# Altium project Triumvi_v9_mcu.PrjPcb
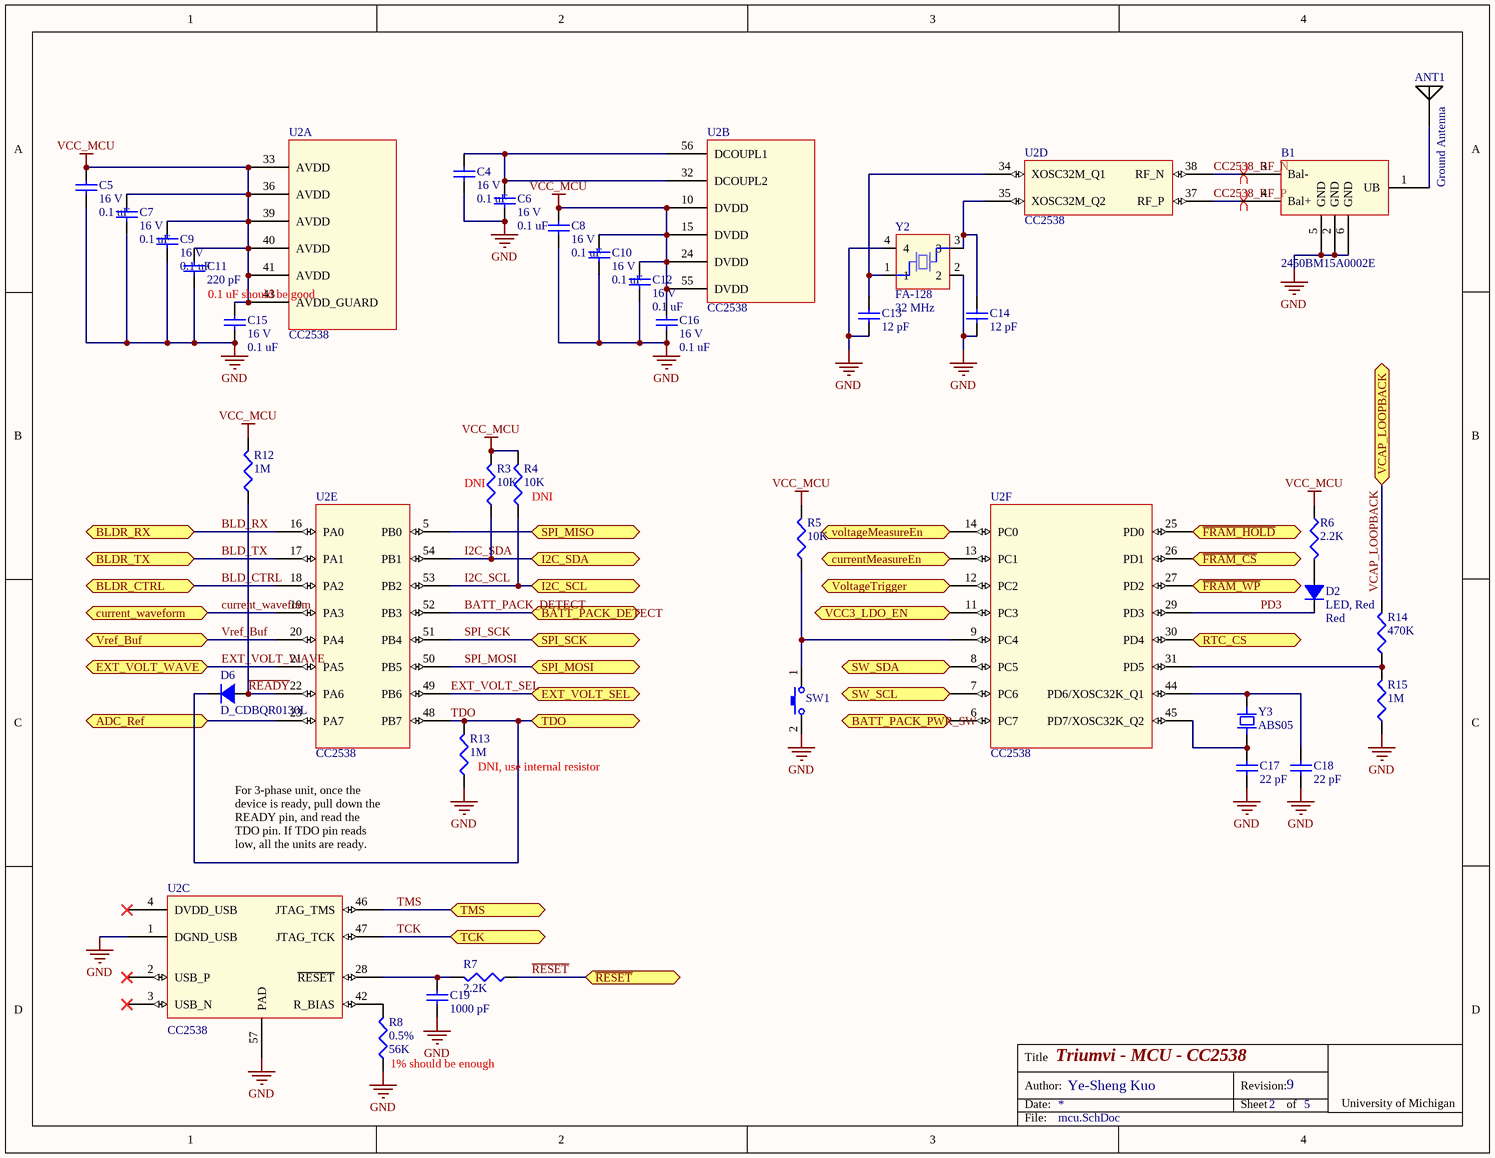
[diagram p0: mcu.SchDoc]
3 sheets, 56 parts. Net scope: flat (ports and power ports of the same name join across sheets).
Board files: triumvi_v9_mcu.PcbDoc, triumvi_v9_mcu_panel.PcbDoc
Sheets:
  mcu.SchDoc
  power_supply.SchDoc
  connectors.SchDoc

## Sheet mcu.SchDoc: Triumvi - MCU - CC2538
size Letter; Author: Ye-Sheng Kuo; Revision: 9; SheetNumber: 2; SheetTotal: 5

### Parts
ANT1  Ground Antenna  [Chip Antenna]
B1  2450BM15A0002E  [2450BM15A0002]
C4  value 0.1 uF  voltage rated: 16 V  [0402]  (hidden comment: Ceramic capacitor)
C5  value 0.1 uF  voltage rated: 16 V  [0402]  (hidden comment: Ceramic capacitor)
C6  value 0.1 uF  voltage rated: 16 V  [0402]  (hidden comment: Ceramic capacitor)
C7  value 0.1 uF  voltage rated: 16 V  [0402]  (hidden comment: Ceramic capacitor)
C8  value 0.1 uF  voltage rated: 16 V  [0402]  (hidden comment: Ceramic capacitor)
C9  value 0.1 uF  voltage rated: 16 V  [0402]  (hidden comment: Ceramic capacitor)
C10  value 0.1 uF  voltage rated: 16 V  [0402]  (hidden comment: Ceramic capacitor)
C11  value 220 pF  [0402]  (hidden comment: Ceramic capacitor)
C12  value 0.1 uF  voltage rated: 16 V  [0402]  (hidden comment: Ceramic capacitor)
C13  value 12 pF  [0402]  (hidden comment: Ceramic capacitor)
C14  value 12 pF  [0402]  (hidden comment: Ceramic capacitor)
C15  value 0.1 uF  voltage rated: 16 V  [0402]  (hidden comment: Ceramic capacitor)
C16  value 0.1 uF  voltage rated: 16 V  [0402]  (hidden comment: Ceramic capacitor)
C17  value 22 pF  [0402]  (hidden comment: Ceramic capacitor)
C18  value 22 pF  [0402]  (hidden comment: Ceramic capacitor)
C19  value 1000 pF  [0402]  (hidden comment: Ceramic capacitor)
D2  LED, Red  Color: Red  [0402 - DIODE]
D6  D_CDBQR0130L  [0402 - DIODE]
R3  value 10K  [0402]  (hidden comment: Chip resistor)
R4  value 10K  [0402]  (hidden comment: Chip resistor)
R5  value 10K  [0402]  (hidden comment: Chip resistor)
R6  value 2.2K  [0402]  (hidden comment: Chip resistor)
R7  value 2.2K  [0402]  (hidden comment: Chip resistor)
R8  value 56K  tolerance: 0.5%  [0402]  (hidden comment: Chip resistor)
R12  value 1M  [0402]  (hidden comment: Chip resistor)
R13  value 1M  [0402]  (hidden comment: Chip resistor)
R14  value 470K  [0402]  (hidden comment: Chip resistor)
R15  value 1M  [0402]  (hidden comment: Chip resistor)
SW1  EVQP7C  [EVQP7C]  (value not drawn)
U2  CC2538  [QFN56]  (parts A,B,C,D,E,F of 6)
Y2  FA-128  frequency: 32 MHz  [FA-128]
Y3  ABS05  [ABS05]

### Ports
ADC_Ref, BATT_PACK_DETECT, BATT_PACK_PWR_SW, BLDR_CTRL, BLDR_RX, BLDR_TX, current_waveform, currentMeasureEn, EXT_VOLT_SEL, EXT_VOLT_WAVE, I2C_SCL, I2C_SDA, RTC_CS, SPI_MISO, SPI_MOSI, SPI_SCK, SW_SCL, SW_SDA, TCK, TDO, TMS, VCAP_LOOPBACK, VCC3_LDO_EN, voltageMeasureEn, VoltageTrigger, Vref_Buf, ~{FRAM_CS}, ~{FRAM_HOLD}, ~{FRAM_WP}, ~{RESET}

### Nets
GND: B1.2(GND) B1.5(GND) B1.6(GND) C4.2 C5.2 C6.2 C7.2 C8.2 C9.2 C10.2 C11.2 C12.2 C13.1 C14.1 C15.2 C16.2 C17.2 C18.2 C19.2 R8.2 R13.2 R15.2 SW1.2 U2.1(DGND_USB) U2.57(PAD) Y2.2 Y2.4
VCC_MCU: C5.1 C7.1 C8.1 C9.1 C10.1 C11.1 C12.1 C15.1 C16.1 R3.1 R4.1 R5.1 R6.2 R12.1 U2.10(DVDD) U2.15(DVDD) U2.24(DVDD) U2.33(AVDD) U2.36(AVDD) U2.39(AVDD) U2.40(AVDD) U2.41(AVDD) U2.43(AVDD_GUARD) U2.55(DVDD)
BATT_PACK_DETECT: U2.52(PB3) ; port BATT_PACK_DETECT
BLD_CTRL: U2.18(PA2) ; port BLDR_CTRL
BLD_RX: U2.16(PA0) ; port BLDR_RX
BLD_TX: U2.17(PA1) ; port BLDR_TX
CC2538_RF_N: B1.3(Bal-) U2.38(RF_N)
CC2538_RF_P: B1.4(Bal+) U2.37(RF_P)
current_waveform: U2.19(PA3) ; port current_waveform
EXT_VOLT_SEL: U2.49(PB6) ; port EXT_VOLT_SEL
EXT_VOLT_WAVE: U2.21(PA5) ; port EXT_VOLT_WAVE
I2C_SCL: R4.2 U2.53(PB2) ; port I2C_SCL
I2C_SDA: R3.2 U2.54(PB1) ; port I2C_SDA
PD3: D2.2 U2.29(PD3)
~{READY}: D6.1 R12.2 U2.22(PA6)
~{RESET}: R7.2 ; port ~{RESET}
SPI_MOSI: U2.50(PB5) ; port SPI_MOSI
SPI_SCK: U2.51(PB4) ; port SPI_SCK
TCK: U2.47(JTAG_TCK) ; port TCK
TDO: D6.2 R13.1 U2.48(PB7) ; port TDO
TMS: U2.46(JTAG_TMS) ; port TMS
VCAP_LOOPBACK: R14.1 ; port VCAP_LOOPBACK
Vref_Buf: U2.20(PA4) ; port Vref_Buf
NetANT1_1: ANT1.1 B1.1(UB)
NetC4_1: C4.1 C6.1 U2.32(DCOUPL2) U2.56(DCOUPL1)
NetC13_2: C13.2 U2.34(XOSC32M_Q1) Y2.1
NetC14_2: C14.2 U2.35(XOSC32M_Q2) Y2.3
NetC17_1: C17.1 U2.45(PD7/XOSC32K_Q2) Y3.2
NetC18_1: C18.1 U2.44(PD6/XOSC32K_Q1) Y3.1
NetC19_1: C19.1 R7.1 U2.28(~{RESET})
NetD2_1: D2.1 R6.1
NetJ1_2: U2.12(PC2) ; port VoltageTrigger
NetJ1_3: U2.8(PC5) ; port SW_SDA
NetJ1_4: U2.7(PC6) ; port SW_SCL
NetJ1_10: U2.11(PC3) ; port VCC3_LDO_EN
NetJ2_8: U2.14(PC0) ; port voltageMeasureEn
NetJ2_9: U2.13(PC1) ; port currentMeasureEn
NetJ2_11: U2.23(PA7) ; port ADC_Ref
NetQ2_5: U2.6(PC7) ; port BATT_PACK_PWR_SW
NetR5_2: R5.2 SW1.1 U2.9(PC4)
NetR8_1: R8.1 U2.42(R_BIAS)
NetR14_2: R14.2 R15.1 U2.31(PD5)
NetU2_5: U2.5(PB0) ; port SPI_MISO
NetU2_25: U2.25(PD0) ; port ~{FRAM_HOLD}
NetU2_26: U2.26(PD1) ; port ~{FRAM_CS}
NetU2_27: U2.27(PD2) ; port ~{FRAM_WP}
NetU2_30: U2.30(PD4) ; port RTC_CS

Not connected (* = marked no-connect by the designer): U2 2(USB_P)* 3(USB_N)* 4(DVDD_USB)*

### Layout directives
differential pair: CC2538_RF_N, CC2538_RF_P

### Notes on the sheet
- (near U2) 0.1 uF should be good
- (near R3) DNI
- (near R4) DNI
- (near R13) DNI, use internal resistor
- For 3-phase unit, once the device is ready, pull down the READY pin, and read the TDO pin. If TDO pin reads low, all the units are ready.
- (near R8) 1% should be enough
- Title
- Date:
- Author:
- Revision:
- Sheet
- of
- University of Michigan
- File:

### Library data of the parts
ANT1 = Ground Antenna: 2.4GHz Surface Mount Device (SMD) On Ground Antenna, 50 Ohms; Supplier 1: RichardsonRFPD; Supplier Part Number 1: FR05-S1-N-0102B
B1 = 2450BM15A0002E: 2.45 GHz Balun for TI CC253X; Supplier 1: Digi-Key; Supplier Part Number 1: 712-1536-1-ND
C4-C10 C12 C15 C16 = C_0.1u_16V_0402_ceramic: Ceramic capacitor, 0.1u, 16 V, 0402 package; Manufacture: Murata; tolerance: 10%; Temperature Coef: X7R; package: 0402; Supplier 1: Digi-Key; Supplier Part Number 1: 490-3261-1-ND
C11 = C_220p_50V_0402_ceramic: Ceramic capacitor, 220 pF, 0402 package; Manufacture: Johanson; voltage rated: 50 V; tolerance: 10%; package: 0402; Temperature: X7R; Supplier 1: Digi-Key; Supplier Part Number 1: 445-1254-1-ND
C13 C14 = C_12p_0402_ceramic: Ceramic capacitor, 12 pF, 0402 package; Manufacture: Johanson; voltage rated: 50 V; tolerance: 2%; package: 0402; Supplier 1: Digi-Key; Supplier Part Number 1: 712-1256-1-ND
C17 C18 = C_22p_0402_ceramic: Ceramic capacitor, 22 pF, 0402 package; Manufacture: Johanson; voltage rated: 50 V; tolerance: 2%; package: 0402; Supplier 1: Digi-Key; Supplier Part Number 1: 712-1274-1-ND
C19 = C_1000p_50V_0402_ceramic: Ceramic capacitor, 1000 pF, 0402 package; Manufacture: TDK; voltage rated: 50 V; tolerance: 10%; package: 0402; Supplier 1: Digi-Key; Supplier Part Number 1: 445-6846-1-ND
D2 = D_LED_RED_0402: LED, Red, 0402; package: 0402; Supplier 1: Digi-Key; Supplier Part Number 1: 511-1593-1-ND
D6 = D_CDBQR0130L: SMD Schottky Barrier Diode; package: 0402; Supplier 1: Digi-Key; Supplier Part Number 1: 641-1271-1-ND
R3-R5 = R_10K_0402: Chip resistor, 10K, 0402 package; tolerance: 1%; power: 1/16 W; Supplier 1: Digi-Key; Supplier Part Number 1: 541-10.0KLCT-ND; package: 0402
R6 R7 = R_2.2K_0402: Chip resistor, 2.2K, 0402 package; tolerance: 1%; power: 1/16 W; package: 0402; Supplier 1: Digi-Key; Supplier Part Number 1: 541-2.20KLCT-ND
R8 = R_56K_0402: Chip resistor, 56K, 0402 package; power: 1/16 W; Temperature coefficient: 25 ppm/C; package: 0402; Supplier 1: Digi-Key; Supplier Part Number 1: P56KDECT-ND
R12 R13 R15 = R_1M_0402: Chip resistor, 1M, 0402 package; tolerance: 1%; power: 1/16 W; Supplier 1: Digi-Key; Supplier Part Number 1: 541-1.00MLCT-ND; package: 0402
R14 = R_470K_0402: Chip resistor, 470K, 0402 package; tolerance: 5%; power: 1/16 W; package: 0402; Supplier 1: Digi-Key; Supplier Part Number 1: 541-470KJCT-ND
SW1 = EVQP7C: 3.5 mm×2.9 mm Side-operational SMD  Light Touch Switches; Supplier 1: Digi-Key; Supplier Part Number 1: P16769CT-ND
U2 = CC2538: A Powerful System-On-Chip for 2.4-GHz IEEE 802.15.4, 6LoWPAN  and ZigBee Applications; Supplier 1: Digi-Key; Supplier Part Number 1: 296-35797-1-ND
Y2 = FA-128: MHz Range Crystal Unit; Load capatance: 10 pF; ESR: 60; stability: 20 ppm; Supplier 1: Digi-Key; Supplier Part Number 1: SER3800CT-ND
Y3 = ABS05: 32768 Hz SMD Low profile crystal; Supplier 1: Digi-Key; Supplier Part Number 1: 535-11899-1-ND

## Sheet power_supply.SchDoc: Triumvi - MCU - Power supply
size Letter; Author: Ye-Sheng Kuo; Revision: 9; SheetNumber: 3; SheetTotal: 5
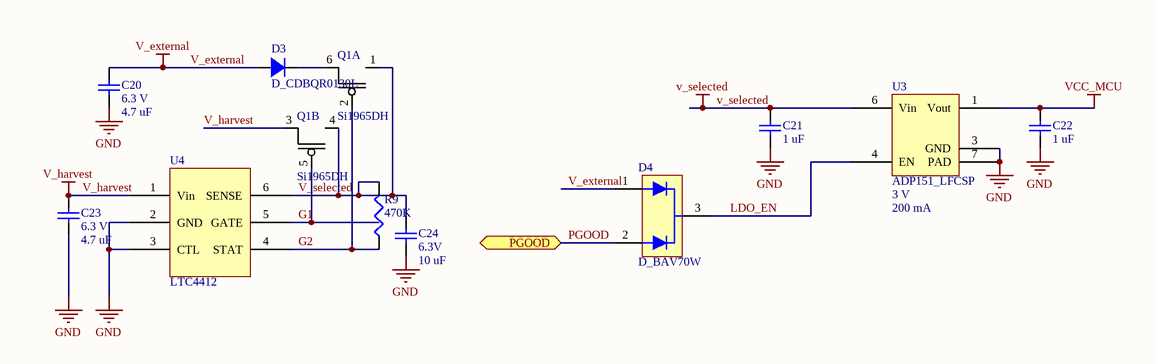
[diagram p1: power_supply.SchDoc]

### Parts
C20  value 4.7 uF  voltage rated: 6.3 V  [0402]  (hidden comment: Ceramic capacitor)
C21  value 1 uF  [0402]  (hidden comment: Ceramic capacitor)
C22  value 1 uF  [0402]  (hidden comment: Ceramic capacitor)
C23  value 4.7 uF  voltage rated: 6.3 V  [0402]  (hidden comment: Ceramic capacitor)
C24  value 10 uF  voltage rated: 6.3V  [0603]  (hidden comment: Ceramic capacitor)
D3  D_CDBQR0130L  [0402 - DIODE]
D4  D_BAV70W  [SOT323]
Q1  Si1965DH  [SC70-6]  (parts A,B of 2)
R9  value 470K  [0402]  (hidden comment: Chip resistor)
U3  ADP151_LFCSP  Voltage: 3 V  Current: 200 mA  [CP-6-3]
U4  LTC4412  [TSOT-23]

### Ports
PGOOD

### Nets
GND: C20.2 C21.2 C22.2 C23.2 C24.2 U3.3(GND) U3.7(PAD) U4.2(GND) U4.3(CTL)
V_external: C20.1 D3.1 D4.1
V_harvest: C23.1 Q1.3(D2) U4.1(Vin)
v_selected: C21.1 C24.1 Q1.1(S1) Q1.4(S2) R9.1 U3.6(Vin) U4.6(SENSE)
VCC_MCU: C22.1 U3.1(Vout)
G1: Q1.5(G2) U4.5(GATE)
G2: Q1.2(G1) R9.2 U4.4(STAT)
LDO_EN: D4.3 U3.4(EN)
PGOOD: D4.2 ; port PGOOD
NetD3_2: D3.2 Q1.6(D1)

### Notes on the sheet
- Title
- Date:
- Author:
- Revision:
- Sheet
- of
- University of Michigan
- File:

### Library data of the parts
C20 C23 = C_4.7u_6.3V_0402_ceramic: Ceramic capacitor, 4.7 uF, 6.3V, 0402 package; Manufacture: Murata; tolerance: 20%; Temperature rating: X5R; package: 0402; Supplier 1: Digi-Key; Supplier Part Number 1: 490-5915-1-ND
C21 C22 = C_1u_16V_0402_ceramic: Ceramic capacitor, 1 uF, 16V, 0402 package; Manufacture: TDK; tolerance: 10%; Temperature rating: X5R; voltage rated: 16 V; package: 0402; Supplier 1: Digi-Key; Supplier Part Number 1: 445-4978-1-ND
C24 = C_10u_6.3V_0603_ceramic: Ceramic capacitor, 10 uF, 0603 package; Manufacture: TDK; tolerance: 20%; package: 0603; Supplier 1: Digi-Key; Supplier Part Number 1: 445-4112-1-ND
D3 = D_CDBQR0130L: SMD Schottky Barrier Diode; package: 0402; Supplier 1: Digi-Key; Supplier Part Number 1: 641-1271-1-ND
D4 = D_BAV70W: DUAL SURFACE MOUNT SWITCHING DIODE; Supplier 1: Digi-Key; Supplier Part Number 1: BAV70W-FDICT-ND
Q1 = Si1965DH: Dual P-Channel 12 V (D-S) MOSFET; Supplier 1: Digi-Key; Supplier Part Number 1: SI1965DH-T1-GE3CT-ND
R9 = R_470K_0402: as R14 on sheet mcu; package: 0402; Supplier 1: Digi-Key; Supplier Part Number 1: 541-470KJCT-ND
U3 = ADP151_LFCSP: Ultralow Noise, 200 mA,  CMOS Linear Regulator; Supplier 1: Digi-Key; Supplier Part Number 1: ADP151ACPZ-3.0-R7CT-ND
U4 = LTC4412: Low Loss PowerPath Controller in ThinSOT; Supplier 1: Digi-Key; Supplier Part Number 1: LTC4412ES6#TRMPBFCT-ND

## Sheet connectors.SchDoc: Triumvi - MCU - Connectors
size Letter; Author: Ye-Sheng Kuo; Revision: 9; SheetNumber: 5; SheetTotal: 5
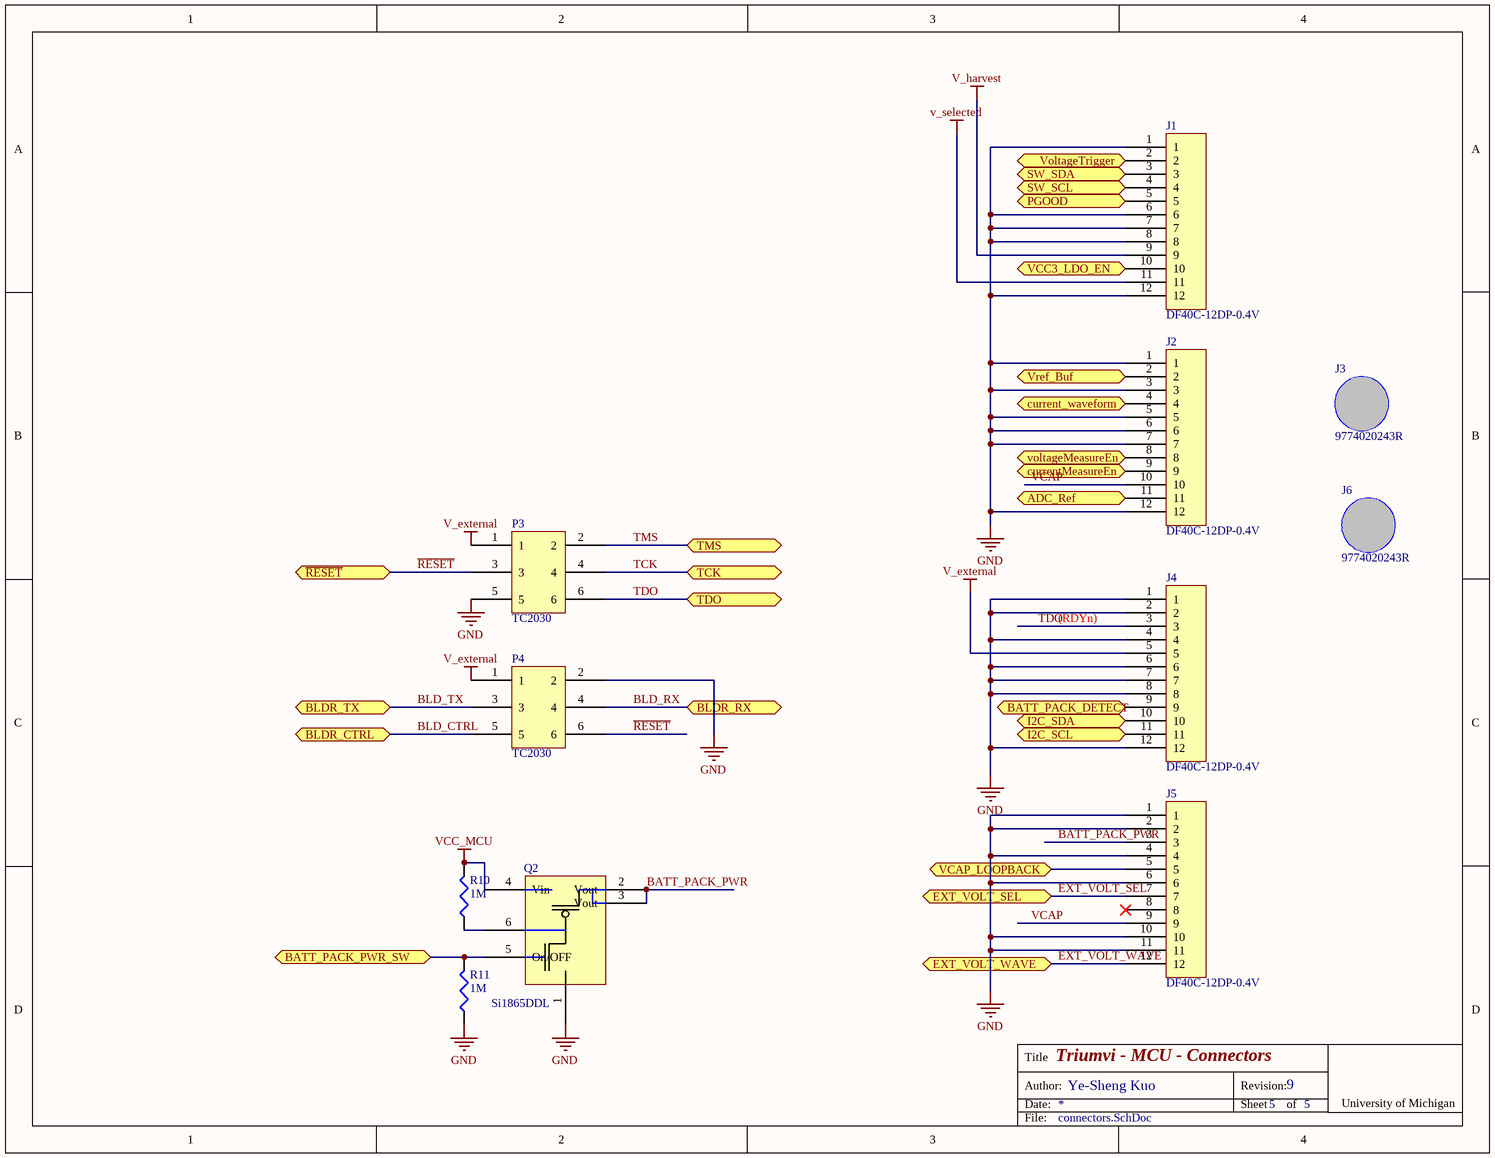
[diagram p2: connectors.SchDoc]

### Parts
J1  DF40C-12DP-0.4V  [DF40C-12DP-0.4V]
J2  DF40C-12DP-0.4V  [DF40C-12DP-0.4V]
J3  9774020243R  [9774020243R]
J4  DF40C-12DP-0.4V  [DF40C-12DP-0.4V]
J5  DF40C-12DP-0.4V  [DF40C-12DP-0.4V]
J6  9774020243R  [9774020243R]
P3  TC2030  [TC2030-IDC-NLFP]
P4  TC2030  [TC2030-IDC-NLFP]
Q2  Si1865DDL  [SC70-6]
R10  value 1M  [0402]  (hidden comment: Chip resistor)
R11  value 1M  [0402]  (hidden comment: Chip resistor)

### Ports
ADC_Ref, BATT_PACK_DETECT, BATT_PACK_PWR_SW, BLDR_CTRL, BLDR_RX, BLDR_TX, current_waveform, currentMeasureEn, EXT_VOLT_SEL, EXT_VOLT_WAVE, I2C_SCL, I2C_SDA, PGOOD, SW_SCL, SW_SDA, TCK, TDO, TMS, VCAP_LOOPBACK, VCC3_LDO_EN, voltageMeasureEn, VoltageTrigger, Vref_Buf, ~{RESET}

### Nets
GND: J1.1 J1.6 J1.7 J1.8 J1.12 J2.1 J2.3 J2.5 J2.6 J2.7 J2.12 J4.1 J4.2 J4.4 J4.6 J4.7 J4.8 J4.12 J5.1 J5.2 J5.4 J5.6 J5.10 J5.11 P3.5 P4.2 Q2.1(S1) R11.2
V_external: J4.5 P3.1 P4.1
V_harvest: J1.9
v_selected: J1.11
VCC_MCU: Q2.4(Vin) R10.1
BATT_PACK_DETECT: J4.9 ; port BATT_PACK_DETECT
BATT_PACK_PWR: J5.3 Q2.2(Vout) Q2.3(Vout)
BLD_CTRL: P4.5 ; port BLDR_CTRL
BLD_RX: P4.4 ; port BLDR_RX
BLD_TX: P4.3 ; port BLDR_TX
current_waveform: J2.4 ; port current_waveform
EXT_VOLT_SEL: J5.7 ; port EXT_VOLT_SEL
EXT_VOLT_WAVE: J5.12 ; port EXT_VOLT_WAVE
I2C_SCL: J4.11 ; port I2C_SCL
I2C_SDA: J4.10 ; port I2C_SDA
PGOOD: J1.5 ; port PGOOD
~{RESET}: P3.3 P4.6 ; port ~{RESET}
TCK: P3.4 ; port TCK
TDO: J4.3 P3.6 ; port TDO
TMS: P3.2 ; port TMS
VCAP: J2.10 J5.9
VCAP_LOOPBACK: J5.5 ; port VCAP_LOOPBACK
Vref_Buf: J2.2 ; port Vref_Buf
NetJ1_2: J1.2 ; port VoltageTrigger
NetJ1_3: J1.3 ; port SW_SDA
NetJ1_4: J1.4 ; port SW_SCL
NetJ1_10: J1.10 ; port VCC3_LDO_EN
NetJ2_8: J2.8 ; port voltageMeasureEn
NetJ2_9: J2.9 ; port currentMeasureEn
NetJ2_11: J2.11 ; port ADC_Ref
NetQ2_5: Q2.5(On/OFF) R11.1 ; port BATT_PACK_PWR_SW
NetQ2_6: Q2.6(D1) R10.2

Not connected (* = marked no-connect by the designer): J5 8*

### Notes on the sheet
- (RDYn)
- Title
- Date:
- Author:
- Revision:
- Sheet
- of
- University of Michigan
- File:

### Library data of the parts
J1 J2 J4 J5 = DF40C-12DP-0.4V: Hirose BM20 Series, 0.4mm pitch, 12 pos, header; Supplier 1: Digi-Key; Supplier Part Number 1: H124599CT-ND
J3 J6 = 9774020243R: 2 mm stack height, m2 standoff; Supplier 1: Digi-Key; Supplier Part Number 1: 732-7073-1-ND
P3 P4 = TC2030: TC2030-MCP-NL
Q2 = Si1865DDL: Load Switch with Level-Shift; Supplier 1: Digi-Key; Supplier Part Number 1: SI1865DDL-T1-GE3CT-ND
R10 R11 = R_1M_0402: as R12 on sheet mcu; Supplier 1: Digi-Key; Supplier Part Number 1: 541-1.00MLCT-ND; package: 0402

## Nets that join several sheets
GND: mcu (27 pins), power_supply (9 pins), connectors (28 pins)
V_external: power_supply (C20.1 D3.1 D4.1), connectors (J4.5 P3.1 P4.1)
V_harvest: power_supply (C23.1 Q1.3 U4.1), connectors (J1.9)
v_selected: power_supply (7 pins), connectors (J1.11)
VCC_MCU: mcu (24 pins), power_supply (C22.1 U3.1), connectors (Q2.4 R10.1)
BATT_PACK_DETECT: mcu (U2.52), connectors (J4.9)
BLD_CTRL: mcu (U2.18), connectors (P4.5)
BLD_RX: mcu (U2.16), connectors (P4.4)
BLD_TX: mcu (U2.17), connectors (P4.3)
current_waveform: mcu (U2.19), connectors (J2.4)
EXT_VOLT_SEL: mcu (U2.49), connectors (J5.7)
EXT_VOLT_WAVE: mcu (U2.21), connectors (J5.12)
I2C_SCL: mcu (R4.2 U2.53), connectors (J4.11)
I2C_SDA: mcu (R3.2 U2.54), connectors (J4.10)
NetJ1_2: mcu (U2.12), connectors (J1.2)
NetJ1_3: mcu (U2.8), connectors (J1.3)
NetJ1_4: mcu (U2.7), connectors (J1.4)
NetJ1_10: mcu (U2.11), connectors (J1.10)
NetJ2_8: mcu (U2.14), connectors (J2.8)
NetJ2_9: mcu (U2.13), connectors (J2.9)
NetJ2_11: mcu (U2.23), connectors (J2.11)
NetQ2_5: mcu (U2.6), connectors (Q2.5 R11.1)
PGOOD: power_supply (D4.2), connectors (J1.5)
~{RESET}: mcu (R7.2), connectors (P3.3 P4.6)
TCK: mcu (U2.47), connectors (P3.4)
TDO: mcu (D6.2 R13.1 U2.48), connectors (J4.3 P3.6)
TMS: mcu (U2.46), connectors (P3.2)
VCAP_LOOPBACK: mcu (R14.1), connectors (J5.5)
Vref_Buf: mcu (U2.20), connectors (J2.2)